# Altium schematic sheet AEBS component_FrontV1.2.SchDoc
size A4
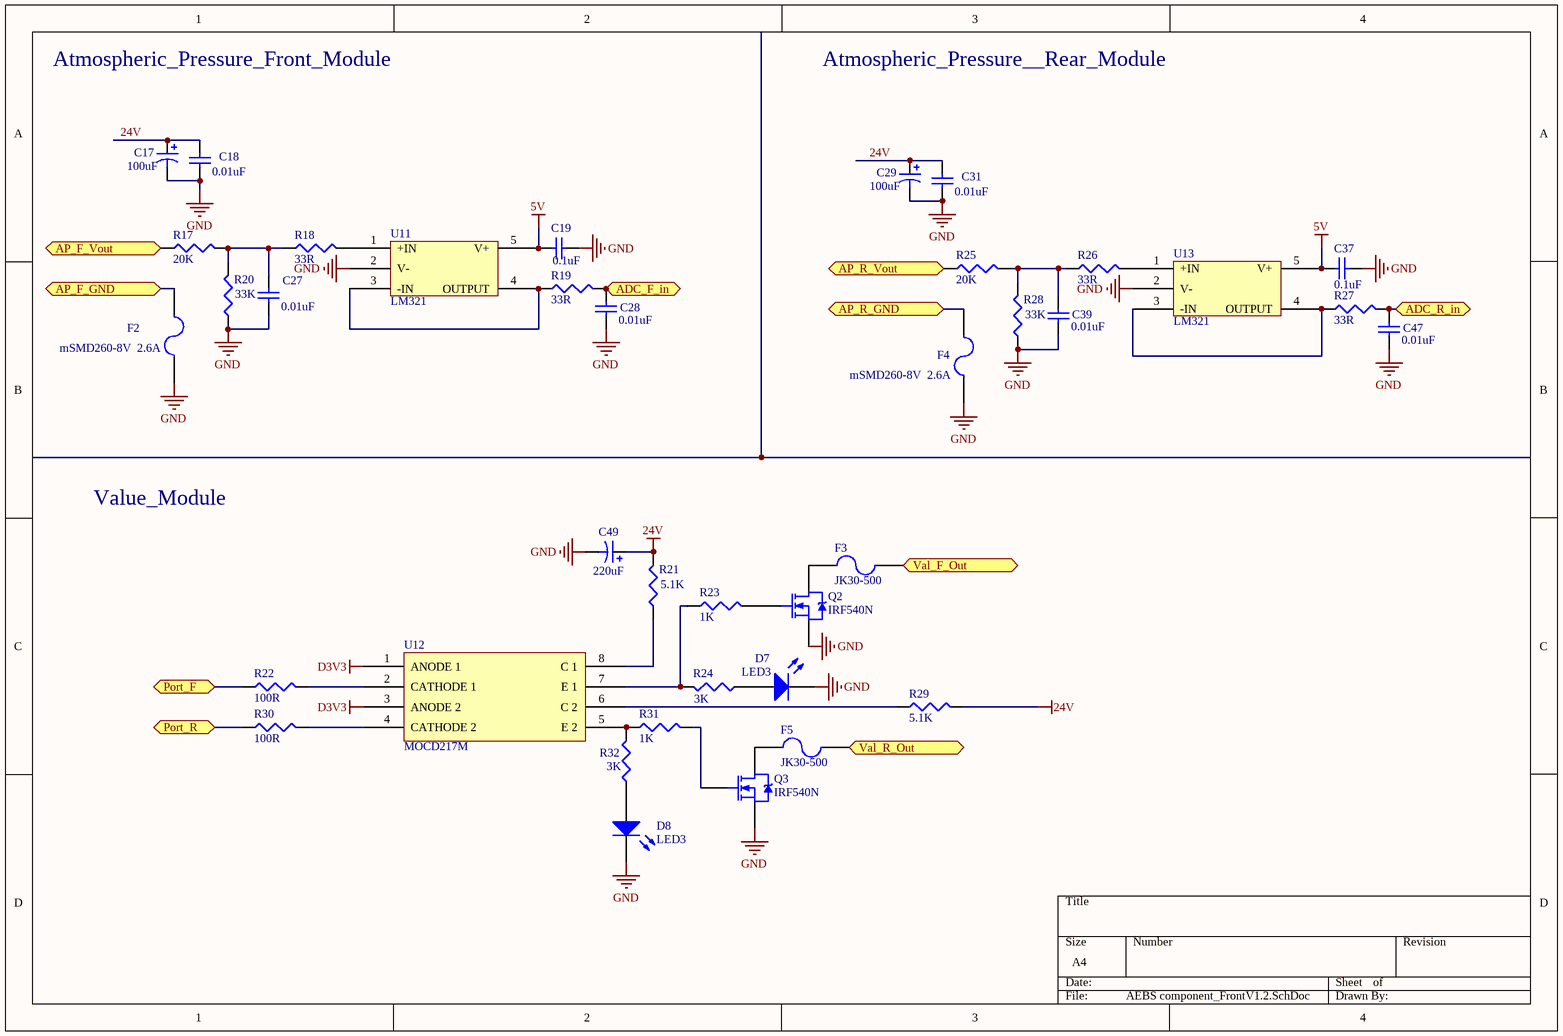
[diagram p0: AEBS component_FrontV1.2.SchDoc]

## Parts
C17  100uF  [CAP_POL_10*10.5]
C18  0.01uF  [0805]
C19  0.1uF  [1608[0603]]
C27  0.01uF  [1608[0603]]
C28  0.01uF  [1608[0603]]
C29  100uF  [CAP_POL_10*10.5]
C31  0.01uF  [0805]
C37  0.1uF  [1608[0603]]
C39  0.01uF  [1608[0603]]
C47  0.01uF  [1608[0603]]
C49  220uF  [CAP_POL_12.5*13.5]
D7  LED3  [1206]
D8  LED3  [1206]
F2  mSMD260-8V  2.6A  [1812]
F3  JK30-500  [JK30-500]
F4  mSMD260-8V  2.6A  [1812]
F5  JK30-500  [JK30-500]
Q2  IRF540N  [TO-220AB]
Q3  IRF540N  [TO-220AB]
R17  20K  [J1-0603]
R18  33R  [J1-0603]
R19  33R  [J1-0603]
R20  33K  [J1-0603]
R21  5.1K  [J1-0603]
R22  100R  [J1-0603]
R23  1K  [J1-0603]
R24  3K  [J1-0603]
R25  20K  [J1-0603]
R26  33R  [J1-0603]
R27  33R  [J1-0603]
R28  33K  [J1-0603]
R29  5.1K  [J1-0603]
R30  100R  [J1-0603]
R31  1K  [J1-0603]
R32  3K  [J1-0603]
U11  LM321  [LM321]
U12  MOCD217M  [MOCD217M]
U13  LM321  [LM321]

## Ports
ADC_F_in (bidir), ADC_R_in (bidir), AP_F_GND (bidir), AP_F_Vout (bidir), AP_R_GND (bidir), AP_R_Vout (bidir), Port_F (bidir), Port_R (bidir), Val_F_Out (bidir), Val_R_Out (bidir)

## Nets
5V: C19.2 C37.2 U11.5(V+) U13.5(V+)
24V: C17.1 C18.1 C29.1 C31.1 C49.1 R21.2 R29.2
D3V3: U12.1(ANODE_1) U12.3(ANODE_2)
GND: C17.2 C18.2 C19.1 C27.1 C28.1 C29.2 C31.2 C37.1 C39.1 C47.1 C49.2 D7.2(K) D8.2(K) F2.2 F4.2 Q2.3(S) Q3.3(S) R20.1 R28.1 U11.2(V-) U13.2(V-)
ADC_F_in: C28.2 R19.2 ; port ADC_F_in
ADC_R_in: C47.2 R27.2 ; port ADC_R_in
AP_F_GND: F2.1 ; port AP_F_GND
AP_F_Vout: R17.1 ; port AP_F_Vout
AP_R_GND: F4.1 ; port AP_R_GND
AP_R_Vout: R25.1 ; port AP_R_Vout
Port_F: R22.1 ; port Port_F
Port_R: R30.1 ; port Port_R
Val_F_Out: F3.2 ; port Val_F_Out
Val_R_Out: F5.2 ; port Val_R_Out
NetC27_2: C27.2 R17.2 R18.1 R20.2
NetC39_2: C39.2 R25.2 R26.1 R28.2
NetD7_1: D7.1(A) R24.1
NetD8_1: D8.1(A) R32.1
NetF3_1: F3.1 Q2.2(D)
NetF5_1: F5.1 Q3.2(D)
NetQ2_1: Q2.1(G) R23.2
NetQ3_1: Q3.1(G) R31.2
NetR18_2: R18.2 U11.1(+IN)
NetR19_1: R19.1 U11.3(-IN) U11.4(OUTPUT)
NetR21_1: R21.1 U12.8(C_1)
NetR22_2: R22.2 U12.2(CATHODE_1)
NetR23_1: R23.1 R24.2 U12.7(E_1)
NetR26_2: R26.2 U13.1(+IN)
NetR27_1: R27.1 U13.3(-IN) U13.4(OUTPUT)
NetR29_1: R29.1 U12.6(C_2)
NetR30_2: R30.2 U12.4(CATHODE_2)
NetR31_1: R31.1 R32.2 U12.5(E_2)

## Notes on the sheet
- Atmospheric_Pressure_Front_Module
- Atmospheric_Pressure__Rear_Module
- Value_Module

## Library data of the parts
C17 C29 = Cap Pol3: Polarized Capacitor (Surface Mount); Published: 8-Jun-2000; LatestRevisionDate: 29-May-2009; LatestRevisionNote: IPC-7351 Footprint Added.; PackageReference: C0805; Publisher: Altium Limited; PackageDescription: Chip Capacitor; Value: 100uF
C18 C19 C27 C28 C31 C37 C39 C47 = Cap Semi: Capacitor (Semiconductor SIM Model); Published: 8-Jun-2000; LatestRevisionDate: 29-May-2009; LatestRevisionNote: IPC-7351 Footprint Added.; PackageReference: C1206; Publisher: Altium Limited; PackageDescription: Chip Capacitor
  C18 C27 C28 C31 C39 C47: Value: 0.01uF
  C19 C37: Value: 0.1uF
C49 = Cap Pol1: Polarized Capacitor (Radial); Published: 8-Jun-2000; LatestRevisionDate: 17-Jul-2002; LatestRevisionNote: Re-released for DXP Platform.; PackageReference: RB7.6-15; Publisher: Altium Limited; PackageDescription: Polarized Capacitor (Radial); 2 Leads; Value: 220uF
D7 D8 = LED3: Typical BLUE SiC LED; Published: 8-Jun-2000; LatestRevisionDate: 17-Dec-2003; LatestRevisionNote: PCB Footprint replaced.; DatasheetVersion: 16-Apr-2002; PackageVersion: 16-Apr-2002; PackageReference: 3.5X2.8X1.9; Publisher: Altium Limited; PackageDescription: SM LED; 2 C-Bend Leads; Body 3.5 x 2.8 x 1.9 mm, inc leads (LxWxH typ)
F2-F5 = Fuse 2: Fuse; Published: 8-Jun-2000; LatestRevisionDate: 17-Jul-2002; LatestRevisionNote: Re-released for DXP Platform.; PackageReference: PIN-W2/E2.8; Publisher: Altium Limited; PackageDescription: Thru-Hole; 2 Leads
Q2 Q3 = NMOS-2: N-Channel Power MOSFET; Note: Pin 2 is electrically connected to pin 4.; Published: 8-Jun-2000; LatestRevisionDate: 17-Jul-2002; LatestRevisionNote: Re-released for DXP Platform.; DatasheetVersion: PD-9.814; PackageVersion: Feb-1997; PackageReference: TO-220AB; Publisher: Altium Limited; PackageDescription: TO, Thru-Hole, Vertical, Heatsink Mounted; 3 In-Line Leads; Pitch 2.54 mm; ComponentLink1Description: Manufacturer Link; ComponentLink1URL: http://www.irf.com/
R17-R32 = Res3: Resistor; Published: 8-Jun-2000; LatestRevisionDate: 29-May-2009; LatestRevisionNote: IPC-7351 Footprint Added.; PackageReference: J1-0603; Publisher: Altium Limited; PackageDescription: Chip Resistor
  R17 R25: Value: 20k
  R18 R19 R26 R27: Value: 33R
  R20 R28: Value: 33k
  R21 R29: Value: 5.1K
  R22 R30: Value: 100R
  R23 R31: Value: 1K
  R24 R32: Value: 3K